# Altium schematic sheet schumann_exp.SchDoc: Tigresse experiment
size 420 x 297 mm; Author: Damien POIX; CompanyName: Space'Tech Orléans; SheetNumber: 1; SheetTotal: 3
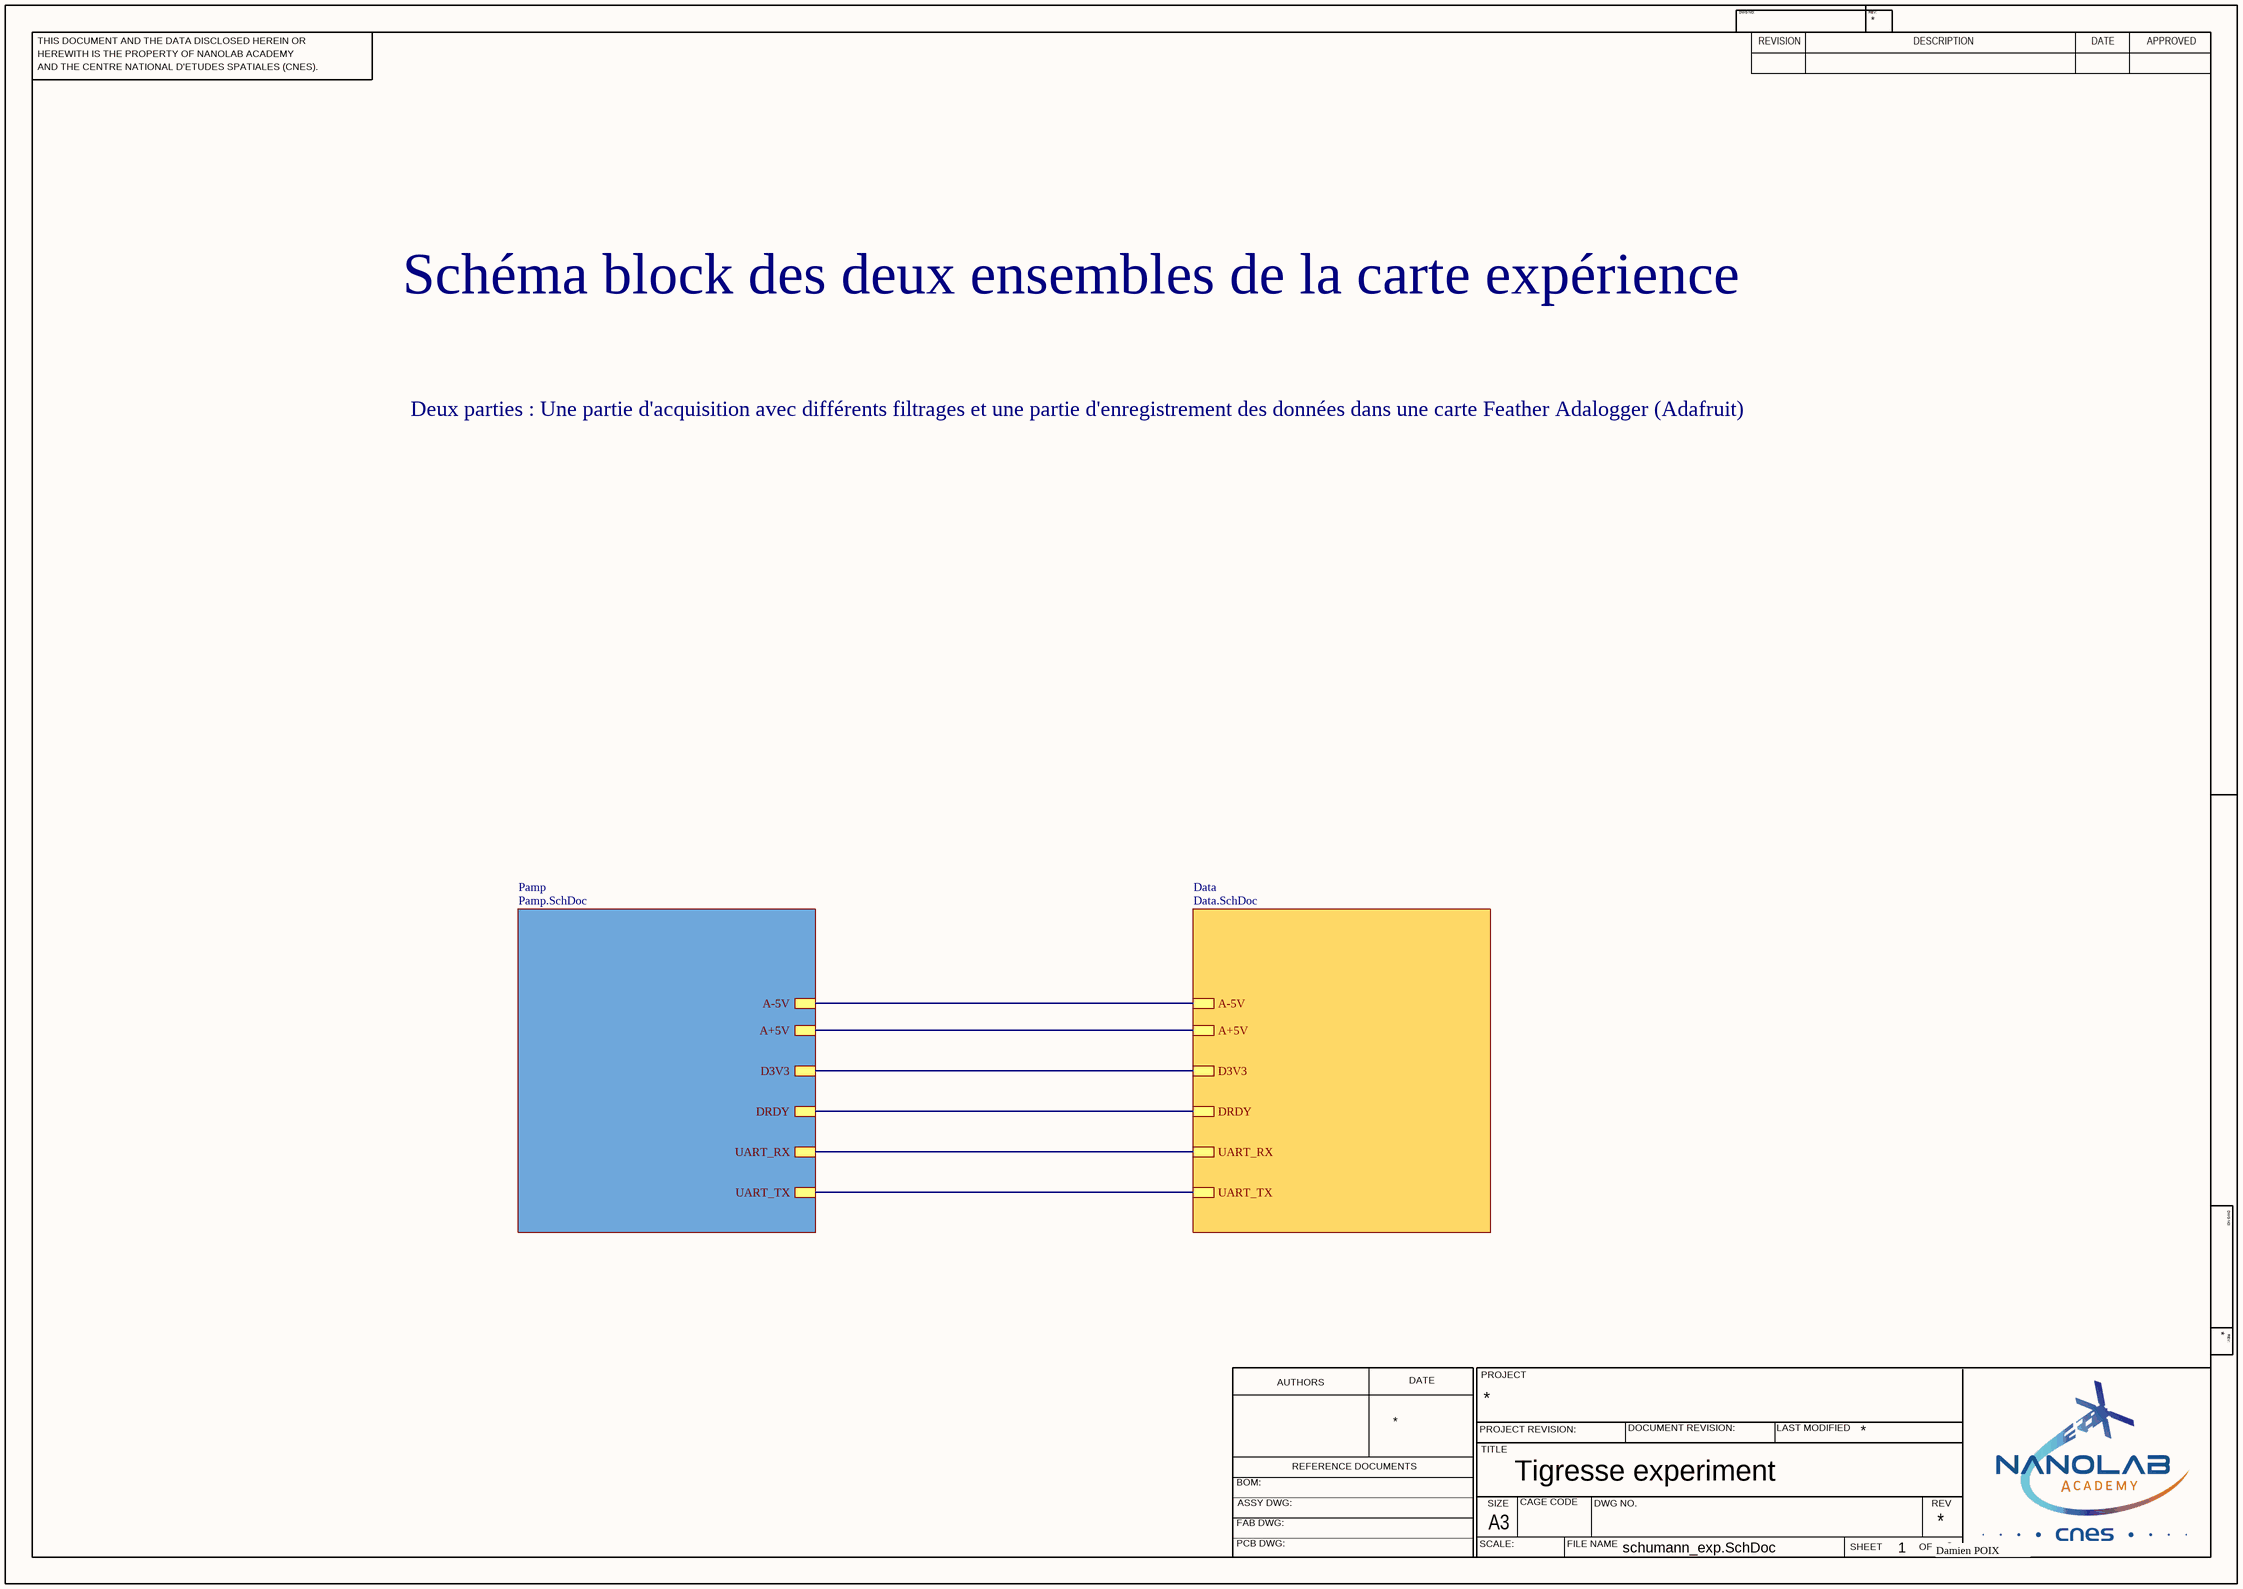
[diagram p0: schumann_exp.SchDoc]

## Sub-sheets
Data = Data.SchDoc: UART_TX, UART_RX, DRDY, D3V3, A+5V, A-5V
Pamp = Pamp.SchDoc: UART_RX, UART_TX, DRDY, D3V3, A+5V, A-5V

## Nets
(unnamed): sheet Pamp/UART_RX, sheet Data/UART_RX
(unnamed): sheet Pamp/UART_TX, sheet Data/UART_TX
(unnamed): sheet Pamp/DRDY, sheet Data/DRDY
(unnamed): sheet Pamp/D3V3, sheet Data/D3V3
(unnamed): sheet Pamp/A+5V, sheet Data/A+5V
(unnamed): sheet Pamp/A-5V, sheet Data/A-5V

## Notes on the sheet
- Schéma block des deux ensembles de la carte expérience
- Deux parties : Une partie d'acquisition avec différents filtrages et une partie d'enregistrement des données dans une carte Feather Adalogger (Adafruit)
- Damien POIX
- THIS DOCUMENT AND THE DATA DISCLOSED HEREIN OR
- HEREWITH IS THE PROPERTY OF NANOLAB ACADEMY
- DWG NO:
- REVISION
- REV:
- DESCRIPTION
- DATE
- APPROVED
- AND THE CENTRE NATIONAL D'ETUDES SPATIALES (CNES).
- AUTHORS
- PROJECT
- REFERENCE DOCUMENTS
- PROJECT REVISION:
- TITLE
- DOCUMENT REVISION:
- LAST MODIFIED
- BOM:
- FAB DWG:
- PCB DWG:
- ASSY DWG:
- SCALE:
- SIZE
- A3
- CAGE CODE
- FILE NAME
- DWG NO.
- SHEET
- OF
- REV